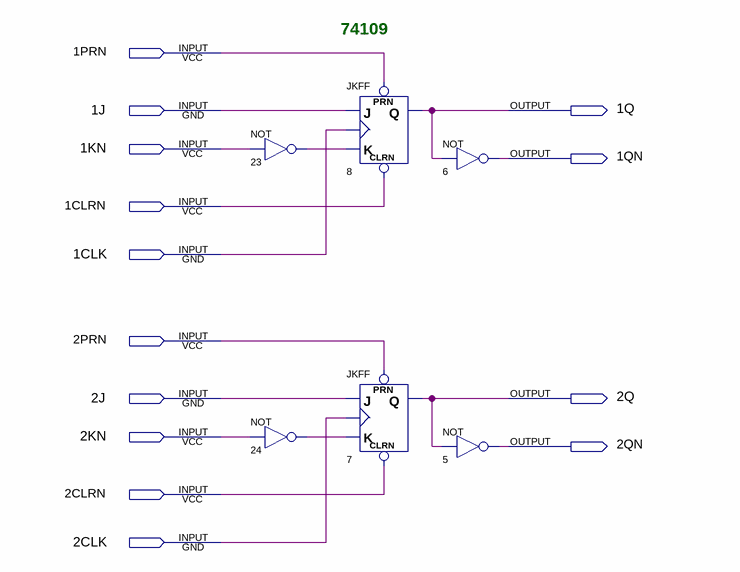
[diagram p0: schematic sheet]
// Quartus schematic 74109.bdf as structural Verilog: 6 symbols, 14 pins
module \74109  (
  input  \1PRN ,
  input  \1J ,
  input  \1KN ,
  input  \1CLRN ,
  input  \1CLK ,
  input  \2PRN ,
  input  \2J ,
  input  \2KN ,
  input  \2CLRN ,
  input  \2CLK ,
  output \1Q ,
  output \1QN ,
  output \2Q ,
  output \2QN 
);

  wire n23_out, n24_out;

  not u_23 (n23_out, \1KN );
  not u_24 (n24_out, \2KN );
  JKFF u_8 (.PRN(\1PRN ), .CLRN(\1CLRN ), .K(n23_out), .J(\1J ), .CLK(\1CLK ), .Q(\1Q ));
  JKFF u_7 (.PRN(\2PRN ), .CLRN(\2CLRN ), .K(n24_out), .J(\2J ), .CLK(\2CLK ), .Q(\2Q ));
  not u_6 (\1QN , \1Q );
  not u_5 (\2QN , \2Q );

  // Notes on the sheet:
  //   74109
endmodule
